# Altium schematic sheet POWER_SWITCH.SchDoc
size A; SheetNumber: 4; SheetTotal: 7
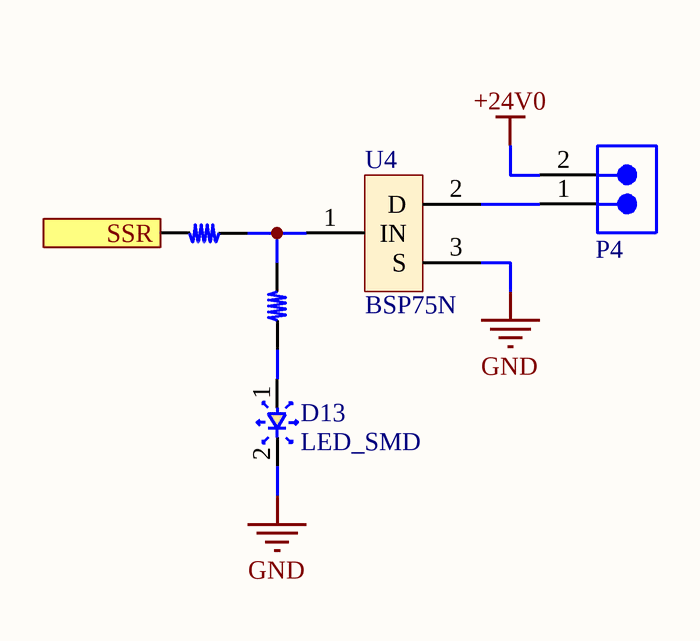
[diagram p0: POWER_SWITCH.SchDoc]

## Parts
D13  LED_SMD  [D 0603]
P4  691321300002  [691321300002]  (value not drawn)
R12  RES_SMD  [R 0603]  (value not drawn)
R13  RES_SMD  [R 0603]  (value not drawn)
U4  BSP75N  [SOT-223 - BSP75N]

## Ports
SSR (in)

## Nets
+24V0: P4.2
GND: D13.2 U4.3(S)
SSR: R12.2 ; port SSR
NetD13_1: D13.1 R13.1
NetP4_1: P4.1 U4.2(D)
NetR12_1: R12.1 R13.2 U4.1(IN)

## Library data of the parts
P4 = 691321300002: WR-TBL Series 321 Vertical PCB Header, Through Hole, pitch 3.81mm, 2p; Manufacturer: Wurth Elektronik; Pin Number: 2; Rated Current: 10A; Working Voltage: 300V; Modularity: No; ComponentLink1Description: Manufacturer Link; ComponentLink1URL: https://www.we-online.com/redexpert/article/691321300002?ad; ComponentLink2Description: Datasheet; ComponentLink2URL: https://www.we-online.com/redexpert/spec/691321300002?ad; Category: Terminal Blocks; Match Code: WR-TBL; Manufacturer Part Number: 691321300002; Mount: Through Hole; Operating Temperature Max: 105°C; Operating Temperature Min: -40°C; Packaging: Box; Pitch: 3.81mm; Orientation: Vertical; Application: Pluggable; PCB/Cable/Panel: PCB